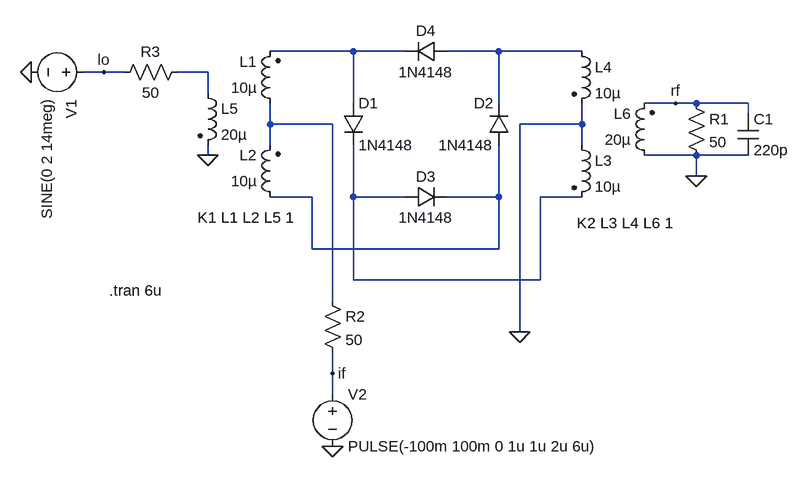
[diagram p0: schematic modulator.asc]
modulator.asc, the LTspice schematic file:
Version 4
SHEET 1 932 756
WIRE 176 64 48 64
WIRE 256 64 176 64
WIRE 400 64 320 64
WIRE 528 64 400 64
WIRE -208 96 -240 96
WIRE -176 96 -208 96
WIRE -48 96 -96 96
WIRE -48 128 -48 96
WIRE 176 144 176 64
WIRE 400 144 400 64
WIRE 672 144 624 144
WIRE 704 144 672 144
WIRE 784 144 704 144
WIRE 784 160 784 144
WIRE 48 176 48 144
WIRE 144 176 48 176
WIRE 528 176 528 144
WIRE 528 176 432 176
WIRE 48 208 48 176
WIRE 528 208 528 176
WIRE -48 224 -48 208
WIRE 704 224 624 224
WIRE 784 224 704 224
WIRE 704 256 704 224
WIRE 112 288 48 288
WIRE 176 288 176 208
WIRE 256 288 176 288
WIRE 400 288 400 208
WIRE 400 288 320 288
WIRE 528 288 464 288
WIRE 112 368 112 288
WIRE 400 368 400 288
WIRE 400 368 112 368
WIRE 176 416 176 288
WIRE 464 416 464 288
WIRE 464 416 176 416
WIRE 144 448 144 176
WIRE 432 496 432 176
WIRE 144 560 144 528
WIRE 144 592 144 560
FLAG 432 496 0
FLAG -48 224 0
FLAG -320 96 0
FLAG 144 672 0
FLAG 704 256 0
FLAG 144 560 if
FLAG -208 96 lo
FLAG 672 144 rf
SYMBOL diode 160 144 R0
SYMATTR InstName D1
SYMATTR Value 1N4148
SYMBOL diode 416 208 R180
WINDOW 0 24 64 Left 2
WINDOW 3 24 0 Left 2
SYMATTR InstName D2
SYMATTR Value 1N4148
SYMBOL diode 256 304 R270
WINDOW 0 32 32 VTop 2
WINDOW 3 0 32 VBottom 2
SYMATTR InstName D3
SYMATTR Value 1N4148
SYMBOL diode 320 48 R90
WINDOW 0 0 32 VBottom 2
WINDOW 3 32 32 VTop 2
SYMATTR InstName D4
SYMATTR Value 1N4148
SYMBOL ind2 64 160 R180
WINDOW 0 36 80 Left 2
WINDOW 3 36 40 Left 2
SYMATTR InstName L1
SYMATTR Value 10µ
SYMATTR Type ind
SYMBOL ind2 64 304 R180
WINDOW 0 36 80 Left 2
WINDOW 3 36 40 Left 2
SYMATTR InstName L2
SYMATTR Value 10µ
SYMATTR Type ind
SYMBOL ind2 512 192 R0
SYMATTR InstName L3
SYMATTR Value 10µ
SYMATTR Type ind
SYMBOL ind2 512 48 R0
SYMATTR InstName L4
SYMATTR Value 10µ
SYMATTR Type ind
SYMBOL ind2 -64 112 R0
SYMATTR InstName L5
SYMATTR Value 20µ
SYMATTR Type ind
SYMBOL ind2 640 240 R180
WINDOW 0 36 80 Left 2
WINDOW 3 36 40 Left 2
SYMATTR InstName L6
SYMATTR Value 20µ
SYMATTR Type ind
SYMBOL res 688 128 R0
SYMATTR InstName R1
SYMATTR Value 50
SYMBOL voltage -224 96 R90
WINDOW 0 42 34 Left 2
WINDOW 3 40 72 Left 2
WINDOW 123 0 0 Left 0
WINDOW 39 0 0 Left 0
SYMATTR InstName V1
SYMATTR Value SINE(0 2 14meg)
SYMBOL voltage 144 576 R0
WINDOW 123 0 0 Left 0
WINDOW 39 0 0 Left 0
SYMATTR InstName V2
SYMATTR Value PULSE(-100m 100m 0 1u 1u 2u 6u)
SYMBOL res 128 432 R0
SYMATTR InstName R2
SYMATTR Value 50
SYMBOL res -80 80 R90
WINDOW 0 0 56 VBottom 2
WINDOW 3 32 56 VTop 2
SYMATTR InstName R3
SYMATTR Value 50
SYMBOL cap 768 160 R0
SYMATTR InstName C1
SYMATTR Value 220p
TEXT -64 320 Left 2 !K1 L1 L2 L5 1
TEXT 520 328 Left 2 !K2 L3 L4 L6 1
TEXT -200 432 Left 2 !.tran 6u

The netlist it stands for:
* modulator.asc
D1 N001 N006 1N4148
D2 N005 N002 1N4148
D3 N006 N005 1N4148
D4 N002 N001 1N4148
L1 N004 N001 10µ
L2 N005 N004 10µ
L3 0 N006 10µ
L4 N002 0 10µ
L5 N003 0 20µ
L6 0 rf 20µ
R1 rf 0 50
V1 lo 0 SINE(0 2 14meg)
V2 if 0 PULSE(-100m 100m 0 1u 1u 2u 6u)
R2 N004 if 50
R3 N003 lo 50
C1 rf 0 220p
.model D D
.lib standard.dio
K1 L1 L2 L5 1
K2 L3 L4 L6 1
.tran 6u
.backanno
.end